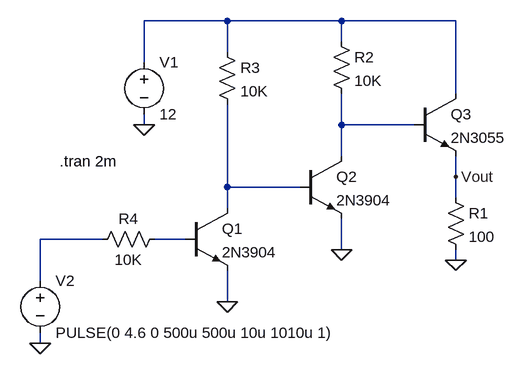
[diagram p0: schematic Current Ramp.asc]
Current Ramp.asc, the LTspice schematic file:
Version 4
SHEET 1 880 680
WIRE 160 -128 32 -128
WIRE 336 -128 160 -128
WIRE 512 -128 336 -128
WIRE 336 -96 336 -128
WIRE 160 -80 160 -128
WIRE 32 -64 32 -128
WIRE 512 -16 512 -128
WIRE 32 32 32 16
WIRE 336 32 336 -16
WIRE 448 32 336 32
WIRE 336 80 336 32
WIRE 512 112 512 80
WIRE 160 128 160 0
WIRE 272 128 160 128
WIRE 512 144 512 112
WIRE 160 160 160 128
WIRE -32 208 -128 208
WIRE 96 208 48 208
WIRE 336 224 336 176
WIRE 512 240 512 224
WIRE -128 272 -128 208
WIRE 160 304 160 256
WIRE -128 368 -128 352
FLAG 160 304 0
FLAG 336 224 0
FLAG -128 368 0
FLAG 32 32 0
FLAG 512 240 0
FLAG 512 112 Vout
SYMBOL npn 96 160 R0
SYMATTR InstName Q1
SYMATTR Value 2N3904
SYMBOL voltage 32 -80 R0
SYMATTR InstName V1
SYMATTR Value 12
SYMBOL voltage -128 256 R0
WINDOW 123 0 0 Left 0
WINDOW 39 0 0 Left 0
SYMATTR InstName V2
SYMATTR Value PULSE(0 4.6 0 500u 500u 10u 1010u 1)
SYMBOL npn 448 -16 R0
SYMATTR InstName Q3
SYMATTR Value 2N3055
SYMBOL npn 272 80 R0
SYMATTR InstName Q2
SYMATTR Value 2N3904
SYMBOL res 496 128 R0
SYMATTR InstName R1
SYMATTR Value 100
SYMBOL res 320 -112 R0
SYMATTR InstName R2
SYMATTR Value 10K
SYMBOL res 144 -96 R0
SYMATTR InstName R3
SYMATTR Value 10K
SYMBOL res 64 192 R90
WINDOW 0 0 56 VBottom 2
WINDOW 3 32 56 VTop 2
SYMATTR InstName R4
SYMATTR Value 10K
TEXT -98 88 Left 2 !.tran 2m

The netlist it stands for:
* Current Ramp.asc
Q1 N003 N005 0 0 2N3904
V1 N001 0 12
V2 N004 0 PULSE(0 4.6 0 500u 500u 10u 1010u 1)
Q3 N001 N002 Vout 0 2N3055
Q2 N002 N003 0 0 2N3904
R1 Vout 0 100
R2 N001 N002 10K
R3 N001 N003 10K
R4 N005 N004 10K
.model NPN NPN
.model PNP PNP
.lib standard.bjt
.tran 2m
.backanno
.end